# Altium schematic sheet SRAM.SchDoc
size A
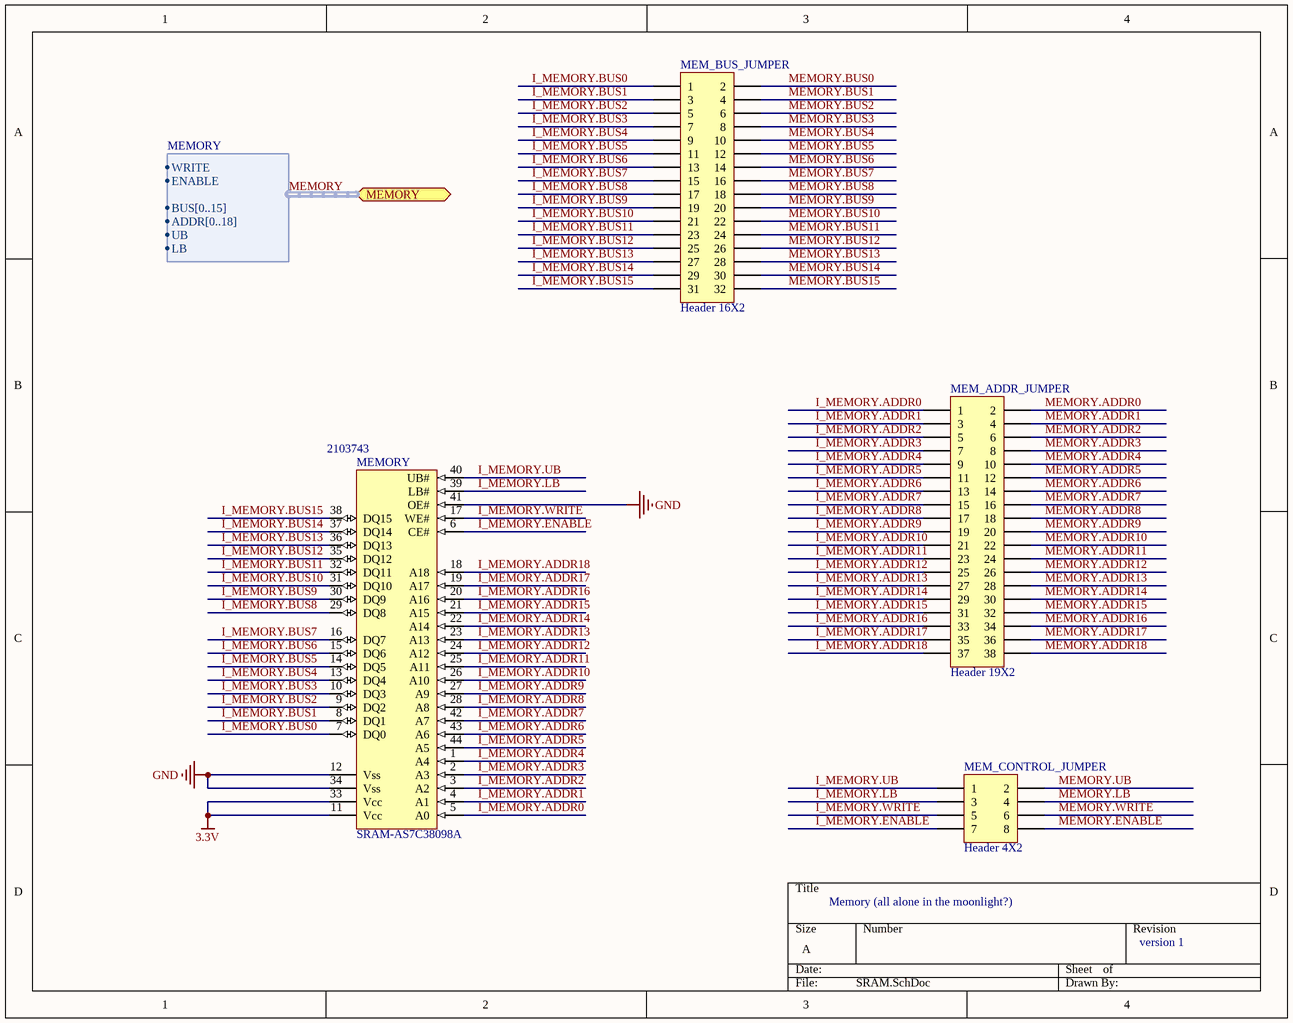
[diagram p0: SRAM.SchDoc]

## Parts
MEM_ADDR_JUMPER  Header 19X2  [HDR2X19]
MEM_BUS_JUMPER  Header 16X2  [HDR2X16]
MEM_CONTROL_JUMPER  Header 4X2  [HDR2X4]
MEMORY  SRAM-AS7C38098A  Supplier Part Number 1: 2103743  [AS7C38098A-10TIN]

## Ports
MEMORY (harness MEMORY)

## Harnesses
MEMORY: WRITE, ENABLE, BUS[0..15], ADDR[0..18], UB, LB

## Nets
3.3V: MEMORY.11(Vcc) MEMORY.33(Vcc)
GND: MEMORY.12(Vss) MEMORY.34(Vss) MEMORY.41(OE#)
I_MEMORY.ADDR0: MEM_ADDR_JUMPER.1 MEMORY.5(A0)
I_MEMORY.ADDR1: MEM_ADDR_JUMPER.3 MEMORY.4(A1)
I_MEMORY.ADDR2: MEM_ADDR_JUMPER.5 MEMORY.3(A2)
I_MEMORY.ADDR3: MEM_ADDR_JUMPER.7 MEMORY.2(A3)
I_MEMORY.ADDR4: MEM_ADDR_JUMPER.9 MEMORY.1(A4)
I_MEMORY.ADDR5: MEM_ADDR_JUMPER.11 MEMORY.44(A5)
I_MEMORY.ADDR6: MEM_ADDR_JUMPER.13 MEMORY.43(A6)
I_MEMORY.ADDR7: MEM_ADDR_JUMPER.15 MEMORY.42(A7)
I_MEMORY.ADDR8: MEM_ADDR_JUMPER.17 MEMORY.28(A8)
I_MEMORY.ADDR9: MEM_ADDR_JUMPER.19 MEMORY.27(A9)
I_MEMORY.ADDR10: MEM_ADDR_JUMPER.21 MEMORY.26(A10)
I_MEMORY.ADDR11: MEM_ADDR_JUMPER.23 MEMORY.25(A11)
I_MEMORY.ADDR12: MEM_ADDR_JUMPER.25 MEMORY.24(A12)
I_MEMORY.ADDR13: MEM_ADDR_JUMPER.27 MEMORY.23(A13)
I_MEMORY.ADDR14: MEM_ADDR_JUMPER.29 MEMORY.22(A14)
I_MEMORY.ADDR15: MEM_ADDR_JUMPER.31 MEMORY.21(A15)
I_MEMORY.ADDR16: MEM_ADDR_JUMPER.33 MEMORY.20(A16)
I_MEMORY.ADDR17: MEM_ADDR_JUMPER.35 MEMORY.19(A17)
I_MEMORY.ADDR18: MEM_ADDR_JUMPER.37 MEMORY.18(A18)
I_MEMORY.BUS0: MEM_BUS_JUMPER.1 MEMORY.7(DQ0)
I_MEMORY.BUS1: MEM_BUS_JUMPER.3 MEMORY.8(DQ1)
I_MEMORY.BUS2: MEM_BUS_JUMPER.5 MEMORY.9(DQ2)
I_MEMORY.BUS3: MEM_BUS_JUMPER.7 MEMORY.10(DQ3)
I_MEMORY.BUS4: MEM_BUS_JUMPER.9 MEMORY.13(DQ4)
I_MEMORY.BUS5: MEM_BUS_JUMPER.11 MEMORY.14(DQ5)
I_MEMORY.BUS6: MEM_BUS_JUMPER.13 MEMORY.15(DQ6)
I_MEMORY.BUS7: MEM_BUS_JUMPER.15 MEMORY.16(DQ7)
I_MEMORY.BUS8: MEM_BUS_JUMPER.17 MEMORY.29(DQ8)
I_MEMORY.BUS9: MEM_BUS_JUMPER.19 MEMORY.30(DQ9)
I_MEMORY.BUS10: MEM_BUS_JUMPER.21 MEMORY.31(DQ10)
I_MEMORY.BUS11: MEM_BUS_JUMPER.23 MEMORY.32(DQ11)
I_MEMORY.BUS12: MEM_BUS_JUMPER.25 MEMORY.35(DQ12)
I_MEMORY.BUS13: MEM_BUS_JUMPER.27 MEMORY.36(DQ13)
I_MEMORY.BUS14: MEM_BUS_JUMPER.29 MEMORY.37(DQ14)
I_MEMORY.BUS15: MEM_BUS_JUMPER.31 MEMORY.38(DQ15)
I_MEMORY.ENABLE: MEM_CONTROL_JUMPER.7 MEMORY.6(CE#)
I_MEMORY.LB: MEM_CONTROL_JUMPER.3 MEMORY.39(LB#)
I_MEMORY.UB: MEM_CONTROL_JUMPER.1 MEMORY.40(UB#)
I_MEMORY.WRITE: MEM_CONTROL_JUMPER.5 MEMORY.17(WE#)
MEMORY.ADDR0: MEM_ADDR_JUMPER.2
MEMORY.ADDR1: MEM_ADDR_JUMPER.4
MEMORY.ADDR2: MEM_ADDR_JUMPER.6
MEMORY.ADDR3: MEM_ADDR_JUMPER.8
MEMORY.ADDR4: MEM_ADDR_JUMPER.10
MEMORY.ADDR5: MEM_ADDR_JUMPER.12
MEMORY.ADDR6: MEM_ADDR_JUMPER.14
MEMORY.ADDR7: MEM_ADDR_JUMPER.16
MEMORY.ADDR8: MEM_ADDR_JUMPER.18
MEMORY.ADDR9: MEM_ADDR_JUMPER.20
MEMORY.ADDR10: MEM_ADDR_JUMPER.22
MEMORY.ADDR11: MEM_ADDR_JUMPER.24
MEMORY.ADDR12: MEM_ADDR_JUMPER.26
MEMORY.ADDR13: MEM_ADDR_JUMPER.28
MEMORY.ADDR14: MEM_ADDR_JUMPER.30
MEMORY.ADDR15: MEM_ADDR_JUMPER.32
MEMORY.ADDR16: MEM_ADDR_JUMPER.34
MEMORY.ADDR17: MEM_ADDR_JUMPER.36
MEMORY.ADDR18: MEM_ADDR_JUMPER.38
MEMORY.BUS0: MEM_BUS_JUMPER.2
MEMORY.BUS1: MEM_BUS_JUMPER.4
MEMORY.BUS2: MEM_BUS_JUMPER.6
MEMORY.BUS3: MEM_BUS_JUMPER.8
MEMORY.BUS4: MEM_BUS_JUMPER.10
MEMORY.BUS5: MEM_BUS_JUMPER.12
MEMORY.BUS6: MEM_BUS_JUMPER.14
MEMORY.BUS7: MEM_BUS_JUMPER.16
MEMORY.BUS8: MEM_BUS_JUMPER.18
MEMORY.BUS9: MEM_BUS_JUMPER.20
MEMORY.BUS10: MEM_BUS_JUMPER.22
MEMORY.BUS11: MEM_BUS_JUMPER.24
MEMORY.BUS12: MEM_BUS_JUMPER.26
MEMORY.BUS13: MEM_BUS_JUMPER.28
MEMORY.BUS14: MEM_BUS_JUMPER.30
MEMORY.BUS15: MEM_BUS_JUMPER.32
MEMORY.ENABLE: MEM_CONTROL_JUMPER.8
MEMORY.LB: MEM_CONTROL_JUMPER.4
MEMORY.UB: MEM_CONTROL_JUMPER.2
MEMORY.WRITE: MEM_CONTROL_JUMPER.6

## Buses and harness runs
harness MEMORY = port MEMORY

## Notes on the sheet
- Memory (all alone in the moonlight?)
- version 1

## Library data of the parts
MEM_ADDR_JUMPER = Header 19X2: Header, 19-Pin, Dual row; LatestRevisionDate: 17-Jul-2002; LatestRevisionNote: Re-released for DXP Platform.; Publisher: Altium Limited
MEM_BUS_JUMPER = Header 16X2: Header, 16-Pin, Dual row; LatestRevisionDate: 17-Jul-2002; LatestRevisionNote: Re-released for DXP Platform.; Publisher: Altium Limited
MEM_CONTROL_JUMPER = Header 4X2: Header, 4-Pin, Dual row; LatestRevisionDate: 17-Jul-2002; LatestRevisionNote: Re-released for DXP Platform.; Publisher: Altium Limited
MEMORY = memchip-AS7C38098A: Manufacturer: ALLIANCE MEMORY; Description: ALLIANCE MEMORY - AS7C38098A-10TIN - SRAM, 8MBIT, 512KX16, 3.3V, 44TSOPII; Memory Size: 8; Memory Configuration: 512K x 16; Supply Voltage Min: 2.7; Supply Voltage Max: 3.6; Memory Case Style: TSOP-II; No. of Pins: 44; Access Time: 10; Supply Voltage Range: 2.7V to 3.6; Supplier 1: Farnell; Manufacturer Part Number: AS7C38098A-10TIN; RoHS: YES; Stock 1: 76; Pricing 1: 1=105,75, 10=104, 100=83,85, 250=82,2, 500=80,55, 900=78,95 (EUR); Operating Temperature Min: -40; Operating Temperature Max: 85; Packaging: Each; MSL: MSL 3 - 168 hours; Operating Temperature Range: -40°C to +85; ComponentLink1URL: http://www.alliancememory.com/pdf/sram/fa/as7c38098a.pdf; ComponentLink1Description: http://www.alliancememory.com/pdf/sram/fa/as7c38098a.pdf